# EAGLE design AVRProgrammer (EAGLE 9.5.2)
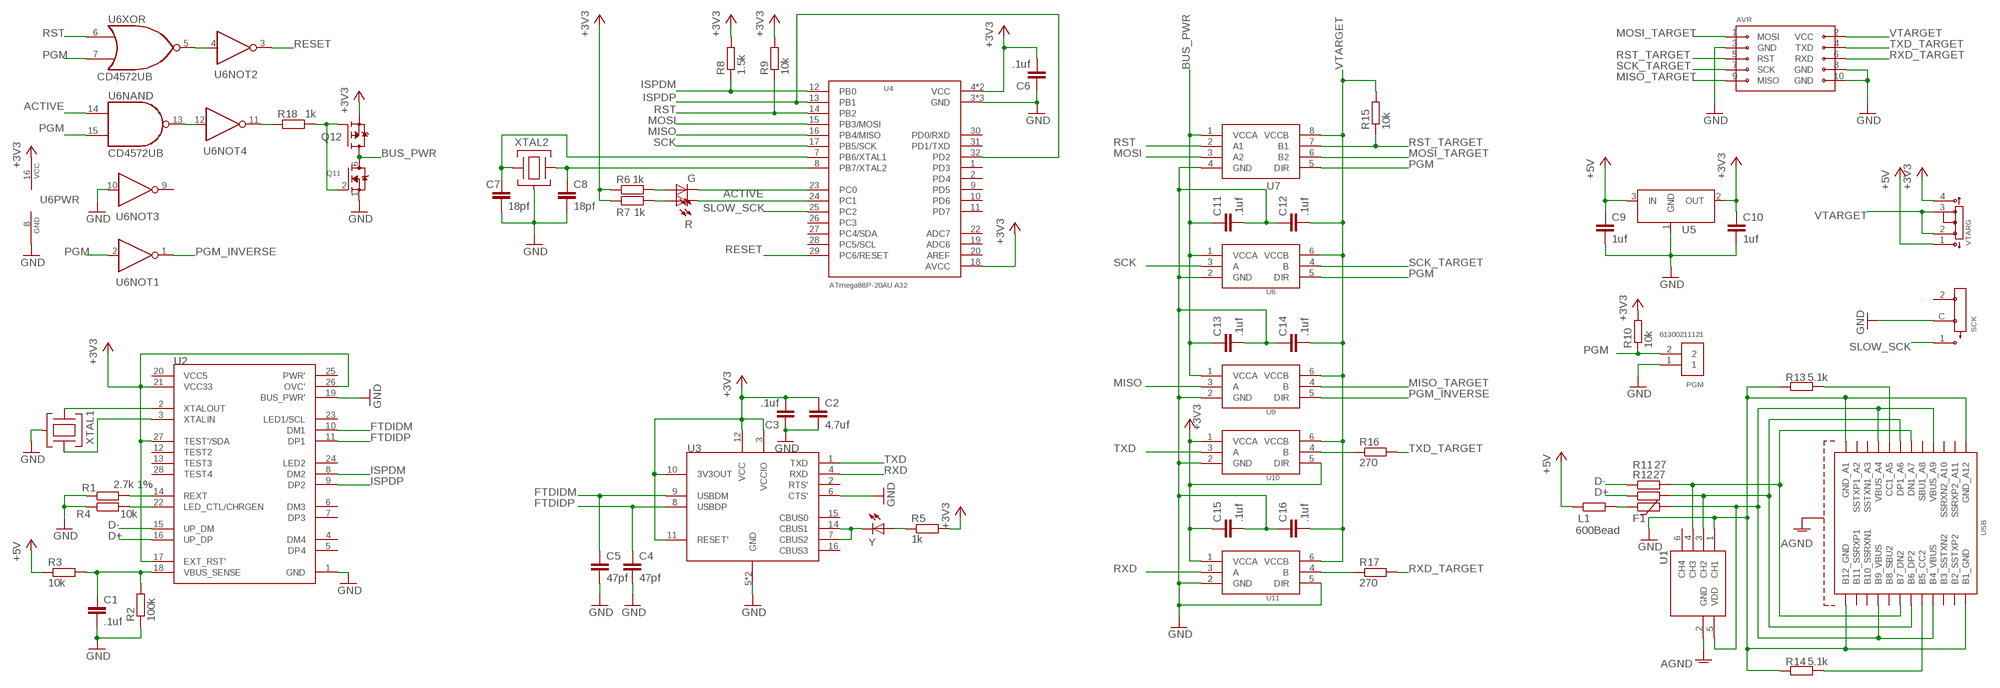
[diagram p0: schematic, sheet 1]

## Parts
AVR  10PIN_ISP10PIN_ISP_RT  [10PIN_ISP_RT]
C1  .1uf  C-EUC0805  [C0805]
C2  4.7uf  C-EUC0805  [C0805]
C3  .1uf  C-EUC0805  [C0805]
C4  47pf  C-EUC0805  [C0805]
C5  47pf  C-EUC0805  [C0805]
C6  .1uf  C-EUC0805  [C0805]
C7  18pf  C-EUC0805  [C0805]
C8  18pf  C-EUC0805  [C0805]
C9  1uf  C-EUC0805  [C0805]
C10  1uf  C-EUC0805  [C0805]
C11  .1uf  C-EUC0805  [C0805]
C12  .1uf  C-EUC0805  [C0805]
C13  .1uf  C-EUC0805  [C0805]
C14  .1uf  C-EUC0805  [C0805]
C15  .1uf  C-EUC0805  [C0805]
C16  .1uf  C-EUC0805  [C0805]
F1  MF-PSHT035KX-2  PTC0805  [FUSC2113X120N]
G  SM0805GCL  LEDCHIPLED_0805  [CHIPLED_0805]
L1  600Bead  R-EU_M0805  [M0805]
PGM  61300211121  [61300211121]
Q1  SI1016CX-T1-GE3SOT-563F  [SOTFL50P160X60-6N]
R  SM0805HCL  LEDCHIPLED_0805  [CHIPLED_0805]
R1  2.7k 1%  R-EU_M0805  [M0805]
R2  100k  R-EU_M0805  [M0805]
R3  10k  R-EU_M0805  [M0805]
R4  10k  R-EU_M0805  [M0805]
R5  1k  R-EU_M0805  [M0805]
R6  1k  R-EU_M0805  [M0805]
R7  1k  R-EU_M0805  [M0805]
R8  1.5k  R-EU_M0805  [M0805]
R9  10k  R-EU_M0805  [M0805]
R10  10k  R-EU_R0805  [R0805]
R11  27  R-EU_M0805  [M0805]
R12  27  R-EU_M0805  [M0805]
R13  5.1k  R-EU_M0805  [M0805]
R14  5.1k  R-EU_M0805  [M0805]
R15  10k  R-EU_R0805  [R0805]
R16  270  R-EU_R0805  [R0805]
R17  270  R-EU_R0805  [R0805]
R18  1k  R-EU_M0805  [M0805]
SCK  SPDT_SWITCH  [SSAJ110100]
U1  D5V0F4U6SO  [SOT95P280X145-6]
U2  XR22404SSOP28  [SOP63P599X173-28]
U3  FT230XSSOP16  [SOP63P599X175-16]
U4  ATmega88P-20AU A32  ATMEGA328P-AUTQFP-32  [QFP80P887X887X120-32]
U5  AZ1117E-3.3SOT-223  [SOT230P700X180-4]
U6  CD4572UB  [SOP65P640X110-16N]
U7  SN74LVC2T45-Q1VSSOP-8  [SOP50P310X90-8N]
U8  SN74LVC1T45DRL  [SOTFL50P160X60-6N]
U9  SN74LVC1T45DRL  [SOTFL50P160X60-6N]
U10  SN74LVC1T45DRL  [SOTFL50P160X60-6N]
U11  SN74LVC1T45DRL  [SOTFL50P160X60-6N]
USB  USBC_FEMALEUJ31-CH-G2-SMT-TR  [USBC_UJ31-CH-G2-SMT-TR]
VTARG  SP3T_SWITCH  [EG1315AA]
XTAL1  XTAL_ABM8AIG  [XTAL_SMT_3.2X2.5]
XTAL2  XTAL_ABM8AIG  [XTAL_SMT_3.2X2.5]
Y  LEDCHIPLED_0805  [CHIPLED_0805]

## Nets
+3V3: C2.1 C3.2 C6.2 C10.1 C15.1 Q1.4(2:S) R5.2 R6.1 R7.1 R8.2 R9.2 R10.2 U2.17(EXT_RST') U2.21(VCC33) U2.26(OVC') U2.27(TEST'/SDA) U3.3(VCCIO) U3.10(3V3OUT) U3.11(RESET') U3.12(VCC) U4.4(VCC) U4.6(VCC) U4.18(AVCC) U5.2(OUT) U6.16(PWR:VCC) U10.1(VCCA) U10.5(DIR) U11.1(VCCA) VTARG.4
+5V: C9.1 L1.1 R3.1 U5.3(IN) VTARG.1
ACTIVE: R.C U4.24(PC1) U6.14(NAND:I0)
AGND: U1.2(GND) USB.SHD$1(SHLD) USB.SHD$2(SHLD) USB.SHD$3(SHLD) USB.SHD$4(SHLD)
BUS_PWR: C11.1 C13.1 Q1.3(2:D) Q1.6(1:D) U7.1(VCCA) U8.1(VCCA) U9.1(VCCA)
D+: R12.1 U2.16(UP_DP)
D-: R11.1 U2.15(UP_DM)
FTDIDM: C5.1 U2.10(DM1) U3.9(USBDM)
FTDIDP: C4.1 U2.11(DP1) U3.8(USBDP)
GND: AVR.3(GND) AVR.8(GND) AVR.10(GND) C1.2 C2.2 C3.1 C4.2 C5.2 C6.1 C7.2 C8.2 C9.2 C10.2 C11.2 C12.1 C13.2 C14.1 C15.2 C16.1 PGM.1 Q1.1(1:S) R1.1 R2.1 R4.1 R13.1 R14.1 SCK.C U1.1(CH1) U2.1(GND) U2.19(BUS_PWR') U3.5(GND) U3.6(CTS') U3.13(GND) U4.3(GND) U4.5(GND) U4.21(GND) U5.1(GND) U6.8(PWR:GND) U6.10(NOT3:A) U7.4(GND) U8.2(GND) U9.2(GND) U10.2(GND) U11.2(GND) U11.5(DIR) USB.A1(GND_A1) USB.A12(GND_A12) USB.B1(B1_GND) USB.B12(B12_GND) XTAL1.2(CASE) XTAL1.4(CASE) XTAL2.2(CASE) XTAL2.4(CASE)
ISPDM: R8.1 U2.8(DM2) U4.12(PB0)
ISPDP: U2.9(DP2) U4.13(PB1) U4.32(PD2)
MISO: U4.16(PB4/MISO) U9.3(A)
MISO_TARGET: AVR.9(MISO) U9.4(B)
MOSI: U4.15(PB3/MOSI) U7.3(A2)
MOSI_TARGET: AVR.1(MOSI) U7.6(B2)
N$1: Q1.2(1:G) Q1.5(2:G) R18.2
N$2: C1.1 R2.2 R3.2 U2.18(VBUS_SENSE)
N$3: U2.2(XTALOUT) XTAL1.1
N$4: R1.2 U2.14(REXT)
N$5: U2.3(XTALIN) XTAL1.3
N$6: R4.2 U2.22(LED_CTL/CHRGEN)
N$7: R13.2 USB.A5(CC1_A5)
N$8: U3.7(CBUS2) U3.14(CBUS1) Y.C
N$9: R5.1 Y.A
N$10: R14.2 USB.B5(B5_CC2)
N$11: R18.1 U6.11(NOT4:Y)
N$13: C7.1 U4.7(PB6/XTAL1) XTAL2.1
N$14: C8.1 U4.8(PB7/XTAL2) XTAL2.3
N$15: F1.1 L1.2
N$17: G.A R6.2
N$18: R7.2 R.A
N$19: G.C U4.23(PC0)
N$22: U6.12(NOT4:A) U6.13(NAND:O)
N$26: U6.4(NOT2:A) U6.5(XOR:O)
N$32: R11.2 U1.4(CH3) USB.A7(DN1_A7) USB.B7(B7_DN2)
N$33: R12.2 U1.3(CH2) USB.A6(DP1_A6) USB.B6(B6_DP2)
N$34: F1.2 U1.5(VDD) USB.A4(VBUS_A4) USB.A9(VBUS_A9) USB.B4(B4_VBUS) USB.B9(B9_VBUS)
N$36: R16.1 U10.4(B)
N$37: R17.1 U11.4(B)
PGM: PGM.2 R10.1 U6.2(NOT1:A) U6.7(XOR:I1) U6.15(NAND:I1) U7.5(DIR) U8.5(DIR)
PGM_INVERSE: U6.1(NOT1:Y) U9.5(DIR)
RESET: U4.29(PC6/RESET) U6.3(NOT2:Y)
RST: R9.1 U4.14(PB2) U6.6(XOR:I0) U7.2(A1)
RST_TARGET: AVR.5(RST) R15.1 U7.7(B1)
RXD: U3.4(RXD) U11.3(A)
RXD_TARGET: AVR.6(RXD) R17.2
SCK: U4.17(PB5/SCK) U8.3(A)
SCK_TARGET: AVR.7(SCK) U8.4(B)
SLOW_SCK: SCK.1 U4.25(PC2)
TXD: U3.1(TXD) U10.3(A)
TXD_TARGET: AVR.4(TXD) R16.2
VTARGET: AVR.2(VCC) C12.2 C14.2 C16.2 R15.2 U7.8(VCCB) U8.6(VCCB) U9.6(VCCB) U10.6(VCCB) U11.6(VCCB) VTARG.2 VTARG.3(C)
Unconnected: SCK.2 U1.6(CH4) U2.4(DM4) U2.5(DP4) U2.6(DM3) U2.7(DP3) U2.12(TEST2) U2.13(TEST3) U2.23(LED1/SCL) U2.24(LED2) U2.25(PWR') U2.28(TEST4) U3.2(RTS') U3.15(CBUS0) U3.16(CBUS3) U4.1(PD3) U4.2(PD4) U4.9(PD5) U4.10(PD6) U4.11(PD7) U4.19(ADC6) U4.20(AREF) U4.22(ADC7) U4.26(PC3) U4.27(PC4/SDA) U4.28(PC5/SCL) U4.30(PD0/RXD) U4.31(PD1/TXD) U6.9(NOT3:Y) USB.A2(SSTXP1_A2) USB.A3(SSTXN1_A3) USB.A8(SBU1_A8) USB.A10(SSRXN2_A10) USB.A11(SSRXP2_A11) USB.B2(B2_SSTXP2) USB.B3(B3_SSTXN2) USB.B8(B8_SBU2) USB.B10(B10_SSRXN1) USB.B11(B11_SSRXP1)

## Power pins joined to a net without a drawn wire
VCC5: U2.20(VCC5)

## Library data of the parts
AVR = pepin:10PIN_ISP
C1-C16 = rcl:C-EU: CAPACITOR, European symbol; SPICEPREFIX: C
F1 = pepin:PTC
G R Y = adafruit:LED: LED OSRAM: - CHIPLED LG R971, LG N971, LY N971, LG Q971, LY Q971, LO R971, LY R971 LH N974, LH R974 LS Q976, LO Q976, LY Q976 LO Q996 - Hyper CHIPLED LW Q18S LB Q993, LB Q99A, LB R99A - SideLED LS A670, LO A670, LY A670, LG A670, LP A670 LB A673, LV A673, LT A673, LW A673 LH A674 LY A675 LS A676, LA A676, LO A676, LY A676, LW A676 LS A679, LY A679, LG A679 - Hyper Micro SIDELED® LS Y876, LA Y876, LO Y876, LY Y876 LT Y87S - SmartLED LW L88C, LW L88S LB L89C, LB L89S, LG L890 LS L89K, LO L89K, LY L89K LS L896, LA L896, LO L896, LY L896 - TOPLED LS T670, LO T670, LY T670, LG T670, LP T670 LSG T670, LSP T670, LSY T670, LOP T670, LYG T670 LG T671, LOG T671, LSG T671 LB T673, LV T673, LT T673, LW T673 LH T674 LS T676, LA T676, LO T676, LY T676, LB T676, LH T676, LSB T676, LW T676 LB T67C, LV T67C, LT T67C, LS T67K, LO T67K, LY T67K, LW E67C LS E67B, LA E67B, LO E67B, LY E67B, LB E67C, LV E67C, LT E67C LW T67C LS T679, LY T679, LG T679 LS T770, LO T770, LY T770, LG T770, LP T770 LB T773, LV T773, LT T773, LW T773 LH T774 LS E675, LA E675, LY E675, LS T675 LS T776, LA T776, LO T776, LY T776, LB T776 LHGB T686 LT T68C, LB T68C - Hyper Mini TOPLED® LB M676 - Mini TOPLED Santana® LG M470 LS M47K, LO M47K, LY M47K Source: http://www.osram.convergy.de/
L1 R1-R3 R5-R7 R10-R18 = rcl:R-EU_: RESISTOR, European symbol; SPICEPREFIX: R
PGM = Headers:61300211121: CONN HEADER VERT 2POS 2.54MM Manufacturer's datasheet <https://katalog.we-online.de/em/datasheet/6130xx11121.pdf>; CREATED_BY: PCBLayout.com; DIGI_KEY_PART_NUMBER: 732-5315-ND; MANUFACTURER: Wurth Electronics Inc.; MPN: 61300211121
Q1 = pepin:SI1016CX-T1-GE3
R4 R8 R9 = pepin:R-EU_: RESISTOR, European symbol
SCK = pepin:SPDT_SWITCH
U1 = pepin:D5V0F4U6SO
U2 = pepin:XR22404
U3 = pepin:FT230X
U4 = pepin:ATMEGA328P-AU
U5 = pepin:AZ1117E-3.3: 3.3v Linear Regulator
U6 = pepin:CD4572UB
U7 = pepin:SN74LVC2T45-Q1
U8-U11 = pepin:SN74LVC1T45
USB = pepin:USBC_FEMALE
VTARG = pepin:SP3T_SWITCH
XTAL1 XTAL2 = pepin:XTAL_ABM8AIG

## Board
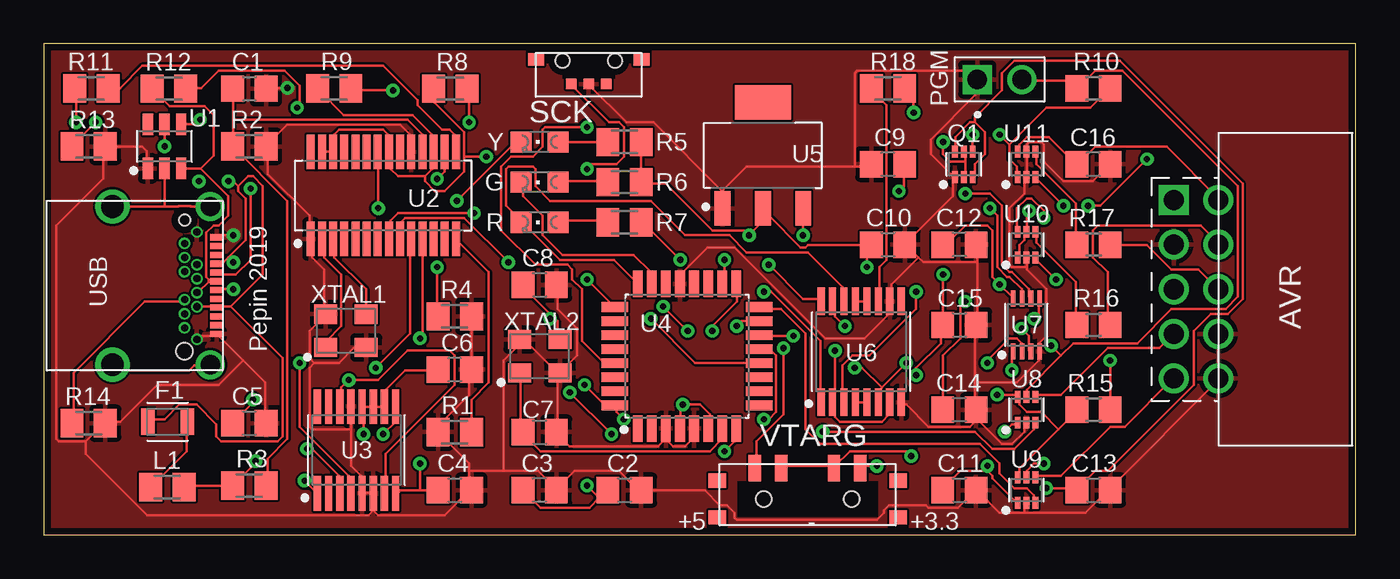
[diagram p1: board, top side]
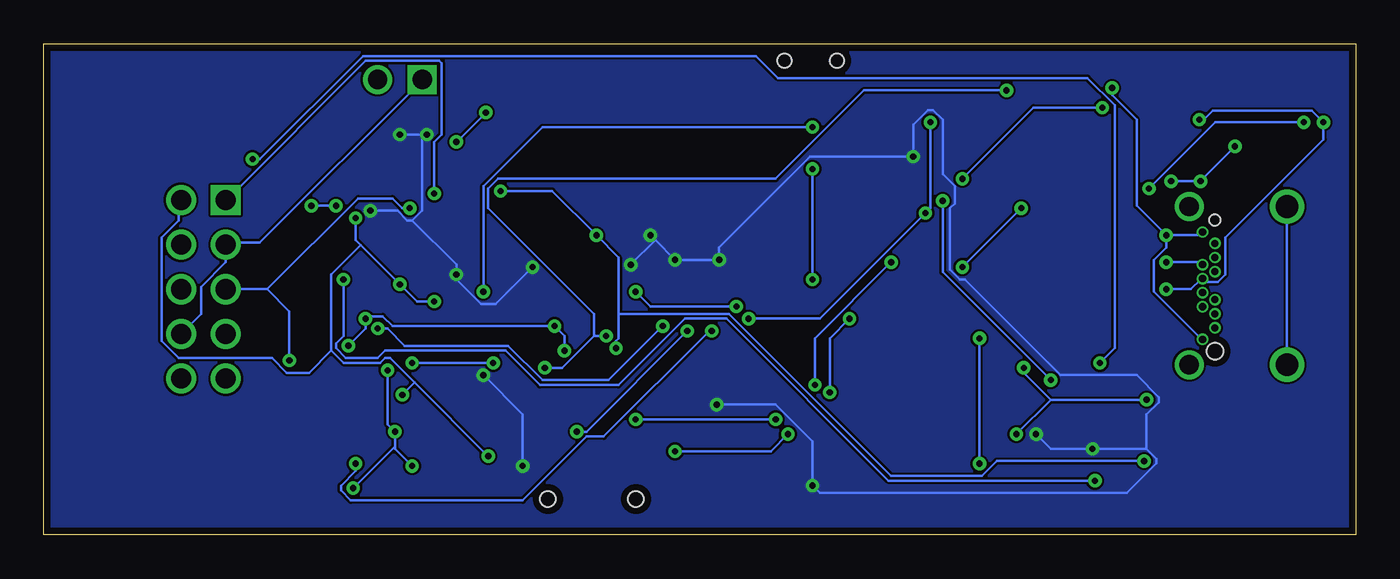
[diagram p2: board, bottom side, seen from below]

Size 74.6 x 27.93 mm. Coordinates in mm from the lower left corner, seen from the top.
Outline: 0,0 74.6,0 74.6,27.93 0,27.93 0,0
Copper layers (1*16): Top 0.035mm / dielectric 1.5mm / Bottom 0.035mm
Design rules "default *": minimum track width 6mil, minimum drill 0.35mm, track to track 5mil, track to pad 5mil, pad to pad 5mil, via to via 5mil, smd to smd 5mil, copper to edge 0.4mm, drill to drill 6mil, minimum pad ring 4.5mil, minimum via ring 8mil, stop-mask expansion 4mil, vias tented up to drill 0.35mm, thermal gap 10mil

### Footprints (pad centres in the part's own frame; a part is rotated, then mirrored left to right if it is on the bottom)
10PIN_ISP_RT = drill 1.14 square: 1 -5.08,-1.27 | drill 1.14: 2 -5.08,1.27; 3 -2.54,-1.27; 4 -2.54,1.27; 5 0,-1.27; 6 0,1.27; 7 2.54,-1.27; 8 2.54,1.27; 9 5.08,-1.27; 10 5.08,1.27
C0805 = smd 1.3 x 1.5: 1 -0.95,0; 2 0.95,0
FUSC2113X120N = smd 0.77 x 1.52: 1 -1.125,0; 2 1.125,0
CHIPLED_0805 = smd 1.2 x 1.2: A 0,-1.05; C 0,1.05
M0805 = smd 1.3 x 1.6: 1 -0.95,0; 2 0.95,0
61300211121 = drill 1.1 square: 1 -1.27,0 | drill 1.1: 2 1.27,0
SOTFL50P160X60-6N = smd 0.673 x 0.337: 1 -0.728,0.5; 2 -0.728,0; 3 -0.728,-0.5; 4 0.728,-0.5; 5 0.728,0; 6 0.728,0.5
R0805 = smd 1.3 x 1.5: 1 -0.95,0; 2 0.95,0
SSAJ110100 = smd 0.6 x 0.6: 1 1,1.27; 2 -1,1.27; C 0,1.27 | smd 0.9 x 0.7: NC1 -3,-0.13; NC2 3,-0.13 | hole 0.8: -1.5,-0.055; 1.5,-0.055
SOT95P280X145-6 = smd 1.209 x 0.584: 1 -1.253,0.95; 2 -1.253,0; 3 -1.253,-0.95; 4 1.253,-0.95; 5 1.253,0; 6 1.253,0.95
SOP63P599X173-28 = smd 1.968 x 0.462: 1 -2.473,4.128; 2 -2.473,3.493; 3 -2.473,2.857; 4 -2.473,2.223; 5 -2.473,1.587; 6 -2.473,0.953; 7 -2.473,0.318; 8 -2.473,-0.318; 9 -2.473,-0.953; 10 -2.473,-1.587; 11 -2.473,-2.223; 12 -2.473,-2.857; 13 -2.473,-3.493; 14 -2.473,-4.128; 15 2.473,-4.128; 16 2.473,-3.493; 17 2.473,-2.857; 18 2.473,-2.223; 19 2.473,-1.587; 20 2.473,-0.953; 21 2.473,-0.318; 22 2.473,0.318; 23 2.473,0.953; 24 2.473,1.587; 25 2.473,2.223; 26 2.473,2.857; 27 2.473,3.493; 28 2.473,4.128
SOP63P599X175-16 = smd 1.972 x 0.414: 1 -2.471,2.223; 2 -2.471,1.587; 3 -2.471,0.953; 4 -2.471,0.318; 5 -2.471,-0.318; 6 -2.471,-0.953; 7 -2.471,-1.587; 8 -2.471,-2.223; 9 2.471,-2.223; 10 2.471,-1.587; 11 2.471,-0.953; 12 2.471,-0.318; 13 2.471,0.318; 14 2.471,0.953; 15 2.471,1.587; 16 2.471,2.223
QFP80P887X887X120-32 = smd 1.504 x 0.547: 1 -4.11,2.8; 2 -4.11,2; 3 -4.11,1.2; 4 -4.11,0.4; 5 -4.11,-0.4; 6 -4.11,-1.2; 7 -4.11,-2; 8 -4.11,-2.8; 17 4.11,-2.8; 18 4.11,-2; 19 4.11,-1.2; 20 4.11,-0.4; 21 4.11,0.4; 22 4.11,1.2; 23 4.11,2; 24 4.11,2.8 | smd 0.547 x 1.504: 9 -2.8,-4.11; 10 -2,-4.11; 11 -1.2,-4.11; 12 -0.4,-4.11; 13 0.4,-4.11; 14 1.2,-4.11; 15 2,-4.11; 16 2.8,-4.11; 25 2.8,4.11; 26 2,4.11; 27 1.2,4.11; 28 0.4,4.11; 29 -0.4,4.11; 30 -1.2,4.11; 31 -2,4.11; 32 -2.8,4.11
SOT230P700X180-4 = smd 1.965 x 0.889: 1 -3.023,2.3; 2 -3.023,0; 3 -3.023,-2.3 | smd 1.965 x 3.189: 4 3.023,0
SOP65P640X110-16N = smd 1.572 x 0.407: 1 -2.872,2.275; 2 -2.872,1.625; 3 -2.872,0.975; 4 -2.872,0.325; 5 -2.872,-0.325; 6 -2.872,-0.975; 7 -2.872,-1.625; 8 -2.872,-2.275; 9 2.872,-2.275; 10 2.872,-1.625; 11 2.872,-0.975; 12 2.872,-0.325; 13 2.872,0.325; 14 2.872,0.975; 15 2.872,1.625; 16 2.872,2.275
SOP50P310X90-8N = smd 0.923 x 0.268: 1 -1.503,0.75; 2 -1.503,0.25; 3 -1.503,-0.25; 4 -1.503,-0.75; 5 1.503,-0.75; 6 1.503,-0.25; 7 1.503,0.25; 8 1.503,0.75
USBC_UJ31-CH-G2-SMT-TR = smd 0.35 x 0.7: A1 -2.75,-0.35; A2 -2.25,-0.35; A3 -1.75,-0.35; A4 -1.25,-0.35; A5 -0.75,-0.35; A6 -0.25,-0.35; A7 0.25,-0.35; A8 0.75,-0.35; A9 1.25,-0.35; A10 1.75,-0.35; A11 2.25,-0.35; A12 2.75,-0.35 | drill 0.4 pad 0.65: B1 3.05,-1.46; B2 2.4,-2.16; B3 1.6,-2.16; B4 1.2,-1.46; B5 0.8,-2.16; B6 0.4,-1.46; B7 -0.4,-1.46; B8 -0.8,-2.16; B9 -1.2,-1.46; B10 -1.6,-2.16; B11 -2.4,-2.16; B12 -3.05,-1.46 | drill 1.1 pad 1.6: SHD$1 -4.5,-0.7; SHD$3 4.5,-0.7 | drill 1.3 pad 1.8: SHD$2 -4.5,-6.26; SHD$4 4.5,-6.26 | hole 0.65: -3.725,-2.16 | hole 0.95: 3.725,-2.16
EG1315AA = smd 0.7 x 1.5: 1 -3,1.75; 2 -1.5,1.75; 3 1.5,1.75; 4 3,1.75 | smd 1 x 0.8: NC1 -5.15,1.05; NC2 5.15,1.05; NC3 -5.15,-1.05; NC4 5.15,-1.05 | hole 0.9: 2.5,0; -2.5,0
XTAL_SMT_3.2X2.5 = smd 1.3 x 1.1: 1 -1.15,-0.95; 2 1.15,-0.95; 3 1.15,0.95; 4 -1.15,0.95

### Placement (x,y rotation side)
AVR  65.53,13.97 270 top
C1  11.68,25.38 0 top
C2  33.02,2.54 0 top
C3  28.19,2.54 180 top
C4  23.37,2.54 0 top
C5  11.68,6.35 0 top
C6  23.37,9.4 180 top
C7  28.19,5.84 0 top
C8  28.19,14.22 0 top
C9  48.01,21.08 180 top
C10  48.01,16.51 0 top
C11  52.07,2.54 0 top
C12  52.07,16.51 180 top
C13  59.69,2.54 0 top
C14  52.07,7.11 180 top
C15  52.07,11.94 0 top
C16  59.69,21.08 180 top
F1  7.03,6.43 180 top
G  28.19,20.07 90 top
L1  7.02,2.71 180 top
PGM  54.36,25.91 0 top
Q1  52.32,21.08 90 top
R  28.19,17.78 90 top
R1  23.37,5.84 0 top
R2  11.68,22.1 180 top
R3  11.68,2.79 0 top
R4  23.37,12.43 180 top
R5  33.02,22.35 0 top
R6  33.02,20.07 180 top
R7  33.02,17.78 180 top
R8  23.11,25.38 180 top
R9  16.51,25.4 180 top
R10  59.69,25.4 0 top
R11  2.7,25.4 180 top
R12  7.11,25.38 180 top
R13  2.54,22.1 180 top
R14  2.54,6.35 180 top
R15  59.69,7.11 180 top
R16  59.69,11.94 0 top
R17  59.69,16.51 0 top
R18  48.01,25.4 0 top
SCK  30.99,26.92 180 top
U1  6.86,22.1 90 top
U2  19.3,19.3 90 top
U3  17.78,4.83 90 top
U4  36.58,10.16 90 top
U5  40.89,21.59 90 top
U6  46.48,10.41 90 top
U7  55.88,11.94 90 top
U8  55.88,7.11 90 top
U9  55.88,2.54 90 top
U10  55.88,16.51 90 top
U11  55.88,21.08 90 top
USB  10.16,14.17 270 top
VTARG  43.43,2.03 0 top
XTAL1  17.18,11.6 0 top
XTAL2  28.19,10.16 0 top
Y  28.19,22.35 90 top

### Tracks (layer width: path | path; a pad name or v marks a point on that pad's centre or on a via)
+3V3  (via drill 0.35)
  Top 0.152: v47.37,3.91 46.53,3.91 VTARG.4 | v49.61,9.08 49.61,9.5 51,10.9 51,11.87 C15.1 51.14,12.01 v51.14,14.81 | U10.1 55.47,15.79 55.47,16.48 55.75,16.76 55.75,17.18 U10.5 55.89,17.32 55.89,18.3 v56.03,18.44 | 54.92,22.21 54.92,21.37 55.33,20.95 55.33,20.4 U11.1 | 54.92,22.21 57.01,24.31 59.53,24.31 60.5,25.29 R10.2 | v52.82,22.77 52.82,21.93 Q1.4 | 54.92,22.21 v54.36,22.77 | C6.2 22.36,9.36 20.55,9.36 19.43,8.24 19.43,7.4 U3.10 19.29,7.26 18.73,7.26 | v14.96,4.89 15.24,4.89 16.78,3.35 16.78,2.38 U3.3 | 18.17,7.26 v18.17,5.73 | 18.17,7.26 18.73,7.26 | 18.17,7.26 U3.12 | 18.73,7.26 U3.11 | U4.4 36.2,6.15 36.2,7.26 v36.34,7.4 37.31,7.4 37.87,6.84 37.87,6.15 U4.6 | 31.59,2.1 32,2.52 C2.1 31.59,2.1 | 31.59,2.1 31.03,1.54 28.23,1.54 27.25,2.52 C3.2 | 31.59,2.1 v30.89,2.79 | U2.27 15.94,21.79 16.36,21.79 U2.26 16.5,21.79 16.5,22.77 16.78,23.05 19.29,23.05 19.57,22.77 19.57,21.79 U2.21 19.71,21.65 19.71,20.82 20.13,20.4 21.67,20.4 | 23.9,21.51 23.9,20.68 22.78,19.56 22.22,19.56 21.67,20.12 21.67,20.4 | 23.9,21.51 23.9,22.91 22.22,24.59 22.22,25.29 R8.2 | 21.67,20.4 22.09,20.82 22.09,21.65 U2.17 22.09,21.79 22.09,22.77 20.97,23.89 17.06,23.89 15.66,25.29 R9.2 | R5.2 33.96,20.12 R6.1 34.1,19.98 35.36,19.98 38.01,17.32 39.83,17.32 v40.11,17.04 41.22,18.16 | 46.81,16.48 43.46,16.48 43.32,16.34 43.04,16.34 41.22,18.16 | 46.81,16.48 46.95,16.48 C10.1 46.81,16.48 | 41.22,18.16 40.95,18.44 U5.2 41.22,18.16 | v38.71,15.65 38.71,14.39 U4.18 | v41.22,15.37 43.18,13.41 44.16,13.41 U6.16 | v36.2,15.65 34.1,17.74 R7.1 | v25.16,21.51 23.9,21.51 | 46.81,16.48 v46.81,15.23
  Bottom 0.152: v47.37,3.91 47.37,6.84 v49.61,9.08 | v54.36,22.77 53.1,22.77 | v56.03,18.44 54.5,18.44 53.94,17.88 53.66,17.88 | 53.66,17.88 53.1,18.44 53.1,22.77 | 53.1,22.77 v52.82,22.77 | 53.66,17.88 51.14,15.37 v51.14,14.81 51.14,14.53 49.75,13.13 48.91,13.13 v46.81,15.23 | v18.17,5.73 17.34,4.89 v14.96,4.89 11.89,4.89 | v36.34,7.4 32.98,7.4 30.89,5.31 v30.89,2.79 30.47,2.38 13,2.38 11.33,4.05 11.33,4.33 11.89,4.89 | v40.11,17.04 39.83,16.76 | 39.83,16.76 v38.71,15.65 v36.2,15.65 36.2,16.34 31.03,21.51 v25.16,21.51 25.16,23.33 24.32,24.17 24.04,24.17 23.48,23.61 23.48,20.54 22.78,19.84 22.78,18.86 23.06,18.58 23.06,15.09 22.5,14.53 22.22,14.53 16.78,9.08 12.45,9.08 11.19,7.82 11.19,7.54 11.89,6.84 11.89,4.89 | 39.83,16.76 v41.22,15.37
  pour Bottom: -2.54,30.48 77.47,30.48 77.47,-2.54 -2.54,-2.54
+5V  (via drill 0.35)
  Top 0.152: L1.1 7.98,2.79 R3.1 10.77,2.79 12.03,4.05 v12.03,4.19 | v42.06,10.62 42.06,6.84 40.53,5.31 40.53,3.91 VTARG.1 | v43.18,17.04 43.18,18.44 U5.3 | v48.63,19.56 48.91,19.84 48.91,20.95 C9.1
  Bottom 0.152: v42.06,10.62 42.06,11.04 41.92,11.18 41.92,12.57 | 41.92,12.57 41.92,15.79 v43.18,17.04 45.7,19.56 v48.63,19.56 | v12.03,4.19 20.41,4.19 21.25,3.35 26.42,3.35 35.64,12.57 41.92,12.57
ACTIVE
  Top 0.152: U4.24 33.68,14.39 32.42,15.65 29.35,15.65 27.25,17.74 R.C 27.11,17.88 26.28,18.72 26.28,20.82 26.42,20.95 27.81,20.95 27.95,20.82 27.95,19.84 28.79,19 34.52,19 36.47,17.04 38.99,17.04 39.97,16.07 43.46,16.07 45.42,14.11 45.42,13.41 U6.14
AGND
  Top 0.152: USB.SHD$3 9.37,9.64 8.53,9.64 8.26,9.36 4.2,9.36 3.92,9.64 USB.SHD$4 | USB.SHD$2 6.86,18.67 | 6.86,18.67 7.64,18.67 7.67,18.7 8.33,18.7 8.36,18.67 USB.SHD$1 | U1.2 6.86,18.67
  Bottom 0.152: USB.SHD$4 3.92,9.78 3.92,18.58 USB.SHD$2
BUS_PWR  (via drill 0.35)
  Top 0.152: 52.96,23.47 53.52,22.91 53.52,21.65 52.96,21.09 52.96,20.4 Q1.3 | 52.96,23.47 52.68,23.47 51.84,22.63 51.84,21.93 Q1.6 | 53.66,3.63 53.94,3.35 53.94,3.21 55.33,1.82 U9.1 | 53.66,3.63 52.12,3.63 51.14,2.65 C11.1 | v54.64,5.87 55.05,6.29 55.33,6.29 U8.1 | 53.66,3.63 v53.66,3.91 | v55.05,9.36 55.05,10.34 U7.1 | v57.01,2.65 58.69,2.65 C13.1 58.83,2.65 59.8,3.63 60.5,3.63 65.39,8.52 65.39,11.6 66.37,12.57 67.35,12.57 68.19,13.41 68.19,19.98 61.2,26.96 55.19,26.96 54.5,26.26 54.5,25.29 52.96,23.75 52.96,23.47
  Bottom 0.152: 54.64,5.03 54.64,4.89 v53.66,3.91 | 54.64,5.03 v54.64,5.87 55.05,6.29 v55.05,9.36 | 54.64,5.03 v57.01,2.65
D+  (via drill 0.35)
  Top 0.152: v14.4,24.31 14.54,24.45 14.54,25.57 13.7,26.4 9.93,26.4 8.95,25.43 8.12,25.43 R12.1 | v22.36,20.26 22.78,20.68 22.78,21.65 U2.16
  Bottom 0.152: v14.4,24.31 18.31,24.31 v22.36,20.26
D-
  Top 0.152: R11.1 3.79,25.43 4.34,25.43 5.6,26.68 19.29,26.68 21.25,24.73 21.25,24.45 22.64,23.05 23.06,23.05 23.34,22.77 23.34,21.79 U2.15
FTDIDM  (via drill 0.35)
  Top 0.152: v11.89,7.68 11.89,7.54 10.77,6.43 C5.1 | v19.29,5.73 19.99,6.43 19.99,7.26 U3.9 | v18.87,9.5 20.83,11.46 20.83,16.76 U2.10
  Bottom 0.152: 17.34,7.68 v11.89,7.68 | v19.29,5.73 17.34,7.68 | v18.87,9.5 18.87,9.22 17.34,7.68
FTDIDP  (via drill 0.35)
  Top 0.152: 21.39,2.52 20.27,2.52 20.13,2.38 U3.8 | 21.39,2.52 22.36,2.52 C4.1 | U2.11 21.53,11.32 v21.39,11.18 | 21.39,2.52 v21.39,4.05
  Bottom 0.152: v21.39,4.05 v21.39,11.18
GND  (via drill 0.35)
  Top 0.152: v10.77,17.04 9.93,17.04 USB.A1 | v13.84,25.43 12.72,25.43 C1.2 | USB.B1 8.81,11.18 8.95,11.32 9.79,11.32 USB.A12 9.93,11.32 11.33,9.92 | 11.33,9.92 12.59,8.66 12.59,6.43 C5.2 | 11.33,9.92 9.93,8.52 6.44,8.52 4.34,6.43 3.5,6.43 R14.1 3.37,6.29 2.39,5.31 | 2.39,5.31 0.85,5.31 0.71,5.45 0.71,17.6 3.37,20.26 3.37,22.07 R13.1 5.59,22.1 5.84,21.84 5.84,20.91 U1.1 | 35.5,5.31 35.5,6.01 U4.3 35.5,5.31 | 35.5,5.31 35.78,5.03 36.47,5.03 36.89,5.45 36.89,6.01 U4.5 | XTAL2.2 29.21,9.22 27.39,11.04 27.11,11.04 XTAL2.4 26.97,11.04 26.97,10.76 26.14,9.92 26.14,3.63 | XTAL2.2 29.21,9.08 29.21,5.87 C7.2 29.21,5.73 29.91,5.03 34.94,5.03 35.22,5.31 35.5,5.31 | C8.2 29.21,14.11 29.21,12.85 30.33,11.73 30.33,10.2 XTAL2.2 | R4.1 24.32,12.29 24.32,9.5 C6.1 24.18,9.36 24.18,7.96 22.5,6.29 22.5,5.87 R1.1 22.5,5.73 24.18,4.05 24.18,3.63 | 24.18,3.63 24.18,2.65 C4.2 24.18,2.52 22.78,1.12 19.01,1.12 18.73,1.4 | 24.18,3.63 26.14,3.63 | 26.14,3.63 28.09,3.63 29.07,2.65 C3.1 29.21,2.65 30.19,3.63 32.7,3.63 33.68,2.65 33.96,2.65 C2.2 34.1,2.52 37.59,2.52 38.43,1.68 38.85,1.68 39.27,1.26 39.27,0.98 39.41,0.84 47.37,0.84 47.79,1.26 47.79,1.4 48.07,1.68 50.17,1.68 50.3,1.54 51.98,1.54 52.96,2.52 C11.2 53.1,2.52 54.36,1.26 55.75,1.26 | 17.47,6.01 17.47,3.91 18.03,3.35 18.03,2.38 U3.5 18.17,2.38 18.73,2.38 U3.6 18.73,1.4 | 17.47,6.01 17.47,7.26 U3.13 | 15.38,9.78 16.78,9.78 17.61,10.62 18.31,10.62 XTAL1.2 | 15.38,9.78 15.1,10.06 15.1,11.6 15.94,12.43 XTAL1.4 15.94,12.57 15.94,15.09 15.24,15.79 15.24,16.76 U2.1 15.1,16.9 15.1,18.16 12.72,20.54 12.72,22.07 R2.1 12.72,22.21 13.84,23.33 20.27,23.33 20.83,22.77 20.83,21.79 U2.19
  Top 0.152: 17.47,6.01 15.24,6.01 15.1,6.15 15.1,9.5 15.38,9.78 | 2.39,5.31 2.39,4.61 5.88,1.12 18.45,1.12 18.73,1.4 | 55.75,1.26 55.75,1.68 U9.2 | 55.75,1.26 59.25,1.26 60.5,2.52 C13.2 60.64,2.65 66.79,8.8 AVR.10 66.79,8.94 66.79,11.32 AVR.8 | 38.57,19.56 34.66,23.47 33.12,23.47 31.03,25.57 SCK.C | 38.57,19.56 38.57,18.58 U5.1 | 46.11,20.95 39.97,20.95 38.57,19.56 | 46.11,20.95 46.95,20.95 C9.2 | 55.89,15.23 55.89,15.09 57.01,13.97 57.01,11.32 56.59,10.9 56.59,10.48 U7.4 56.59,10.34 56.59,9.92 55.33,8.66 52.96,8.66 | 55.89,15.23 55.89,15.65 U10.2 | 55.89,15.23 55.05,15.23 54.92,15.37 54.92,18.58 55.75,19.42 55.75,20.26 U11.2 55.89,20.4 55.89,21.79 U11.5 55.89,21.93 55.89,22.21 56.03,22.35 56.73,22.35 56.87,22.21 56.87,21.23 57.99,20.12 59.67,20.12 60.5,20.95 C16.1 | U4.21 36.2,14.39 36.2,14.81 37.73,16.34 39.27,16.34 44.44,11.18 46.67,11.18 48.07,12.57 48.07,13.27 U6.10 48.21,13.41 48.21,14.25 49.75,15.79 | 53.1,6.57 54.5,5.17 55.05,5.17 55.75,5.87 55.75,6.29 U8.2 | 53.1,6.57 53.1,6.99 C14.1 | 53.1,6.57 52.68,6.15 50.3,6.15 49.05,7.4 48.77,7.4 U6.8 | 53.1,6.57 C14.1 | 53.1,15.51 53.1,16.48 C12.1 | 53.1,15.51 53.1,12.01 C15.2 52.96,11.87 52.96,8.66 | 53.1,15.51 50.03,15.51 49.75,15.79 | 49.75,15.79 49.05,16.48 C10.2 49.05,16.62 51.7,19.28 51.7,20.26 Q1.1 51.7,20.4 50.44,21.65 50.44,22.49 52.96,25.01 52.96,25.84 PGM.1 52.96,25.98 52.54,26.4 46.25,26.4 46.11,26.26 46.11,20.95 | 52.96,8.66 52.96,7.12 C14.1
  Bottom 0.152: v10.77,17.04 8.95,17.04 8.81,17.18 USB.B12 | v13.84,25.43 13.84,25.01 12.45,23.61 12.45,18.72 v10.77,17.04 | v10.77,17.04 10.77,16.34 11.47,15.65 11.47,13.83 8.81,11.18 USB.B1 | AVR.8 66.79,11.46 65.67,12.57 65.67,14.11 64.28,15.51 64.28,16.48 AVR.3 64.14,16.62 62.32,16.62 53.1,25.84 PGM.1
  pour Top: -1.27,29.21 76.2,29.21 76.2,-1.27 -1.27,-1.27
ISPDM  (via drill 0.35)
  Top 0.152: v34.52,12.29 37.03,9.78 40.67,9.78 U4.12 | v24.46,18.3 20.13,18.3 19.71,17.88 19.71,16.9 U2.8 | v24.18,23.47 24.18,25.29 R8.1
  Bottom 0.152: v34.52,12.29 30.47,12.29 v24.46,18.3 24.18,18.58 v24.18,23.47
ISPDP  (via drill 0.35)
  Top 0.152: v32.98,6.57 32.56,6.99 32.56,7.26 U4.32 32.42,7.4 31.86,7.4 v30.75,8.52 | v40.95,6.57 41.22,6.57 41.64,6.99 41.64,10.2 41.36,10.48 40.8,10.48 U4.13 | v26.42,15.51 23.9,18.02 20.55,18.02 20.27,17.74 20.27,16.9 U2.9
  Bottom 0.152: v40.95,6.57 v32.98,6.57 | v26.42,15.51 30.75,11.18 v30.75,8.52
MISO
  Top 0.152: U9.3 56.31,1.82 56.31,2.23 55.89,2.65 55.19,2.65 54.36,3.49 54.36,4.05 53.24,5.17 44.16,5.17 43.32,6.01 43.32,11.46 41.92,12.85 40.8,12.85 U4.16
MISO_TARGET
  Top 0.152: U9.4 56.45,3.35 57.85,3.35 60.64,6.15 61.48,6.15 64.14,8.8 AVR.9
MOSI  (via drill 0.35)
  Top 0.152: v55.61,11.73 56.03,11.32 56.03,10.48 U7.3 | v39.41,11.87 39.69,12.15 40.67,12.15 U4.15
  Bottom 0.152: v55.61,11.73 55.05,11.73 54.08,10.76 48.21,10.76 46.25,8.8 42.48,8.8 v39.41,11.87
MOSI_TARGET  (via drill 0.35)
  Top 0.152: v52.4,19.42 53.8,19.42 54.5,18.72 54.5,15.37 54.92,14.95 55.05,14.95 56.03,13.97 56.03,13.55 U7.6
  Bottom 0.152: v52.4,19.42 52.4,22.35 51.98,22.77 51.98,26.82 52.12,26.96 56.31,26.96 64.14,19.14 AVR.1
N$1  (via drill 0.35)
  Top 0.152: 52.4,21.23 52.4,21.79 Q1.5 | 52.4,21.23 52.4,20.4 Q1.2 | 52.4,21.23 51.56,21.23 51.14,21.65 v51.14,22.35 | v49.47,24.03 49.47,24.87 49.05,25.29 R18.2
  Bottom 0.152: v49.47,24.03 v51.14,22.35
N$2
  Top 0.152: 10.77,23.61 10.77,22.21 R2.2 10.77,22.07 13.84,19 13.84,5.45 12.72,4.33 12.72,2.79 R3.2 | 10.77,23.61 10.77,25.29 C1.1 | U2.18 21.53,22.77 20.69,23.61 10.77,23.61
N$3
  Top 0.152: XTAL1.1 16.08,10.76 16.08,11.04 16.92,11.87 16.92,14.81 15.94,15.79 15.94,16.76 U2.2
N$4
  Top 0.152: R1.2 24.32,5.87 24.32,7.68 25.3,8.66 25.3,14.95 23.48,16.76 U2.14
N$5
  Top 0.152: XTAL1.3 18.31,12.57 18.31,13.97 16.5,15.79 16.5,16.76 U2.3
N$6  (via drill 0.35)
  Top 0.152: v22.36,15.23 22.36,12.43 R4.2 | v19.01,18.58 19.01,21.65 U2.22
  Bottom 0.152: v19.01,18.58 v22.36,15.23
N$7  (via drill 0.35)
  Top 0.152: v11.75,19.7 11.75,15.65 10.91,14.81 9.93,14.81 USB.A5 | v2.95,23.47 1.69,22.21 R13.2
  Bottom 0.152: v11.75,19.7 7.98,23.47 v2.95,23.47
N$8  (via drill 0.35)
  Top 0.152: Y.C 26.84,22.35 v23.48,19 | U3.14 16.92,7.4 16.92,8.38 v17.34,8.8 19.01,8.8 20.69,10.48 23.06,10.48 23.34,10.2 23.34,8.52 19.43,4.61 19.43,2.38 U3.7
  Bottom 0.152: v23.48,19 23.48,14.95 v17.34,8.8
N$9
  Top 0.152: R5.1 Y.A
N$10
  Top 0.152: USB.B5 7.98,13.27 5.74,13.27 1.69,9.22 1.69,6.43 R14.2
N$11
  Top 0.152: U6.11 47.51,13.41 47.51,15.23 47.93,15.65 47.93,24.45 47.09,25.29 R18.1
N$13
  Top 0.152: XTAL2.1 27.11,9.08 27.11,5.87 C7.1 27.25,5.73 28.23,4.75 37.87,4.75 38.57,5.45 38.57,6.01 U4.7
N$14  (via drill 0.35)
  Top 0.152: 28.93,12.43 27.25,14.11 C8.1 | 28.93,12.43 29.21,12.15 29.21,11.18 XTAL2.3 | v38.71,4.75 39.27,5.31 39.27,6.01 U4.8 | v29.91,8.1 v32.28,5.73 | 28.93,12.43 v28.79,12.29
  Bottom 0.152: v38.71,4.75 33.26,4.75 v32.28,5.73 | v29.91,8.1 29.91,11.18 v28.79,12.29
N$15
  Top 0.152: F1.1 8.12,6.43 8.12,4.75 6.16,2.79 L1.2
N$17
  Top 0.152: G.A 29.35,20.12 32,20.12 R6.2
N$18
  Top 0.152: R.A 29.35,17.88 32,17.88 R7.2
N$19
  Top 0.152: G.C 27.25,19.98 27.25,19.28 28.37,18.16 28.37,17.04 29.49,15.93 33.54,15.93 34.52,14.95 34.52,14.39 U4.23
N$22
  Top 0.152: U6.13 46.25,13.27 46.67,13.27 U6.12
N$26
  Top 0.152: U6.4 46.25,7.54 46.67,7.54 U6.5
N$32  (via drill 0.35)
  Top 0.152: v10.77,13.97 9.93,13.97 USB.A7 | v1.83,23.47 1.83,25.29 R11.2 | U1.4 8.62,23.35 v8.89,23.62
  Bottom 0.152: v10.77,13.97 9.37,13.97 8.81,14.53 USB.B7 8.67,14.53 8.53,14.39 7.84,14.39 7.42,14.81 7.42,16.9 1.83,22.49 v1.83,23.47 2.49,24.13 8.13,24.13 8.64,23.62 v8.89,23.62
N$33
  Top 0.152: 9.37,14.39 9.79,14.39 USB.A6 | 9.37,14.39 8.81,13.83 USB.B6 | 9.37,14.39 9.37,14.53 9.23,14.67 9.23,17.18 9.65,17.6 9.93,17.6 10.49,18.16 10.49,19.28 8.92,20.84 | 8.92,20.84 U1.3 | R12.2 7.16,24.38 9.14,24.38 9.65,23.87 9.65,21.57 8.92,20.84
N$34  (via drill 0.35)
  Top 0.152: USB.B4 8.81,12.99 9.79,12.99 USB.A9 9.93,12.99 10.63,12.99 | 10.49,15.79 11.47,16.76 11.47,19.14 11.05,19.56 11.05,19.84 | 10.49,15.79 10.21,15.51 9.93,15.51 USB.A4 | 11.05,19.84 11.61,20.4 11.89,20.4 12.45,19.84 12.45,14.81 10.63,12.99 | v10.49,20.12 10.77,20.12 11.05,19.84 | 10.49,15.79 v10.77,15.51 | 10.63,12.99 13.56,10.06 13.56,5.59 13.28,5.31 10.07,5.31 9.79,5.59 9.79,6.29 8.67,7.4 7.7,7.4 6.86,6.57 6.02,6.57 F1.2 | U1.5 v6.86,22.1
  Bottom 0.152: v10.49,20.12 v8.81,20.12 8.81,20.14 v6.86,22.1 | v10.77,15.51 8.81,15.51 USB.B9
N$36
  Top 0.152: U10.4 56.45,17.18 56.45,16.62 58.69,14.39 58.69,12.01 R16.1
N$37
  Top 0.152: U11.4 56.45,21.79 56.45,21.09 58.69,18.86 58.69,16.62 R17.1
PGM  (via drill 0.35)
  Top 0.152: U6.7 48.07,7.4 48.07,6.84 47.65,6.43 45.28,6.43 45,6.71 45,7.4 U6.2 45,7.54 v45,10.48 | 57.85,10.2 58.55,10.9 62.18,10.9 64.14,12.85 67.21,12.85 67.91,13.55 67.91,19.84 61.34,26.4 59.8,26.4 58.83,25.43 R10.1 58.69,25.43 58.27,25.84 55.75,25.84 PGM.2 | 57.85,10.2 55.89,8.24 55.89,7.96 U8.5 | v56.31,12.29 56.59,12.57 56.59,13.41 U7.5 | 57.85,10.2 v57.29,10.76 | v45.55,11.87 45,12.43 45,13.27 U6.15
  Bottom 0.152: v57.29,10.76 56.31,11.73 v56.31,12.29 56.17,12.43 55.33,12.43 54.78,11.87 v45.55,11.87 45,11.32 v45,10.48
PGM_INVERSE  (via drill 0.35)
  Top 0.152: v56.87,4.05 56.31,4.05 55.89,3.63 55.89,3.35 U9.5 | v35.22,12.99 v36.61,11.6 | v40.95,13.83 41.36,13.83 44.16,11.04 44.16,7.54 U6.1
  Bottom 0.152: v56.87,4.05 56.87,3.63 57.71,2.79 57.71,2.52 57.15,1.96 47.37,1.96 43.74,5.59 42.76,5.59 36.75,11.6 v36.61,11.6 | v35.22,12.99 40.11,12.99 v40.95,13.83
RESET  (via drill 0.35)
  Top 0.152: v30.89,23.19 28.51,23.19 28.37,23.05 28.37,22.07 27.81,21.51 26.56,21.51 26,20.95 26,17.32 27.95,15.37 29.77,15.37 30.05,15.09 30.05,14.53 30.61,13.97 30.61,11.04 31.86,9.78 32.42,9.78 U4.29 | v49.61,13.83 49.61,12.85 46.95,10.2 45.97,10.2 45.42,9.64 45.42,7.54 U6.3
  Bottom 0.152: v30.89,23.19 46.25,23.19 49.61,19.84 v49.61,13.83
RST  (via drill 0.35)
  Top 0.152: v53.66,9.78 53.66,9.92 54.92,11.18 55.33,11.18 55.61,10.9 55.61,10.48 U7.2 | 47.65,8.38 47.51,8.24 47.51,7.54 U6.6 | 47.65,8.38 v49.05,9.78 | v42.62,11.32 40.8,11.32 U4.14 | v46.11,9.5 46.53,9.5 47.65,8.38 | v19.85,25.29 17.47,25.29 R9.1
  Bottom 0.152: v49.05,9.78 v53.66,9.78 | 43.32,11.32 v42.62,11.32 | 43.32,11.32 45.14,9.5 v46.11,9.5 | v19.85,25.29 27.95,25.29 32.98,20.26 48.77,20.26 49.33,19.7 49.33,18.58 43.32,12.57 43.32,11.32
RST_TARGET  (via drill 0.35)
  Top 0.152: v53.8,18.58 54.22,18.16 54.22,15.23 54.78,14.67 54.92,14.67 55.61,13.97 55.61,13.55 U7.7 | v60.64,9.92 60.64,7.12 R15.1
  Bottom 0.152: v53.8,18.58 54.22,18.58 54.78,19.14 56.73,19.14 61.9,13.97 | AVR.5 61.9,13.97 | v60.64,9.92 60.64,12.71 61.9,13.97
RXD  (via drill 0.35)
  Top 0.152: v57.99,18.72 56.45,20.26 U11.3 | v59.39,18.72 60.08,18.72 v62.74,21.37 | v14.54,9.78 14.54,6.15 17.34,3.35 17.34,2.38 U3.4
  Bottom 0.152: v59.39,18.72 v57.99,18.72 | v62.74,21.37 62.32,21.37 56.45,27.24 34.1,27.24 32.84,25.98 15.24,25.98 13.7,24.45 13.7,10.62 v14.54,9.78
RXD_TARGET
  Top 0.152: R17.2 60.64,16.48 62.74,16.48 64.14,15.09 65.67,15.09 AVR.6
SCK  (via drill 0.35)
  Top 0.152: v44.3,5.87 52.96,5.87 53.94,4.89 55.19,4.89 56.31,6.01 56.31,6.29 U8.3 | v38.01,11.6 38.01,11.87 39.41,13.27 39.41,14.25 U4.17
  Bottom 0.152: v44.3,5.87 43.74,5.87 v38.01,11.6
SCK_TARGET
  Top 0.152: U8.4 56.45,7.96 57.85,7.96 60.5,10.62 63.44,10.62 64.14,11.32 AVR.7
SLOW_SCK  (via drill 0.35)
  Top 0.152: v30.89,20.82 31.17,21.09 32.56,21.09 32.98,21.51 32.98,23.19 32.7,23.47 32.14,23.47 30.05,25.57 SCK.1 | v30.89,14.53 32.42,12.99 U4.25
  Bottom 0.152: v30.89,14.53 v30.89,20.82
TXD  (via drill 0.35)
  Top 0.152: v57.57,14.53 56.45,15.65 U10.3 | v14.82,3.07 15.52,2.38 U3.1
  Bottom 0.152: v57.57,14.53 57.57,11.32 57.99,10.9 57.99,10.62 57.43,10.06 55.61,10.06 55.19,10.48 48.35,10.48 46.39,8.52 41.92,8.52 38.15,12.29 35.78,12.29 26.56,3.07 v14.82,3.07
TXD_TARGET
  Top 0.152: R16.2 60.5,12.01 60.5,14.95 59.67,15.79 59.67,17.32 59.94,17.6 65.81,17.6 66.79,16.62 AVR.4
VTARGET  (via drill 0.35)
  Top 0.152: U11.6 55.47,21.93 55.47,22.21 55.89,22.63 57.15,22.63 58.69,21.09 C16.2 58.83,21.09 59.8,22.07 63.86,22.07 66.79,19.14 AVR.2 | 57.71,6.01 58.69,6.99 R15.2 | 57.71,6.01 55.47,3.77 55.47,3.35 U9.6 | 57.71,6.01 56.73,6.99 55.89,6.99 55.47,7.4 55.47,7.82 U8.6 55.33,7.96 v54.22,7.96 | VTARG.2 42.06,3.91 44.86,3.91 VTARG.3 45,3.91 45.83,4.75 49.05,4.75 v49.33,4.47 | v56.87,18.02 56.87,18.44 56.17,19.14 55.89,19.14 55.33,18.58 55.33,17.32 U10.6 | U7.8 55.05,13.55 v54.36,14.25 53.94,14.67 53.94,17.32 53.66,17.6 52.4,17.6 51.42,16.62 51.14,16.62 C12.2 | v52.4,13.27 52.12,12.99 52.12,11.18 51.14,10.2 51.14,7.12 C14.2
  Bottom 0.152: v56.87,18.02 56.87,16.76 56.59,16.48 | 56.59,16.48 v54.36,14.25 53.38,13.27 v52.4,13.27 | 53.52,8.66 54.92,10.06 55.19,10.06 55.47,9.78 57.57,9.78 58.27,10.48 | 53.52,8.66 v49.33,4.47 | 58.27,10.48 58.27,14.81 56.59,16.48 | 53.52,8.66 v54.22,7.96 | 58.27,10.48 59.53,9.22 60.78,9.22 61.62,10.06 66.93,10.06 67.91,11.04 67.91,16.9 66.93,17.88 66.93,19 AVR.2

### Text on the board
tNames: Pepin 2019 | +5 | - | +3.3